# EAGLE design LCD BOARD (EAGLE 6.3)
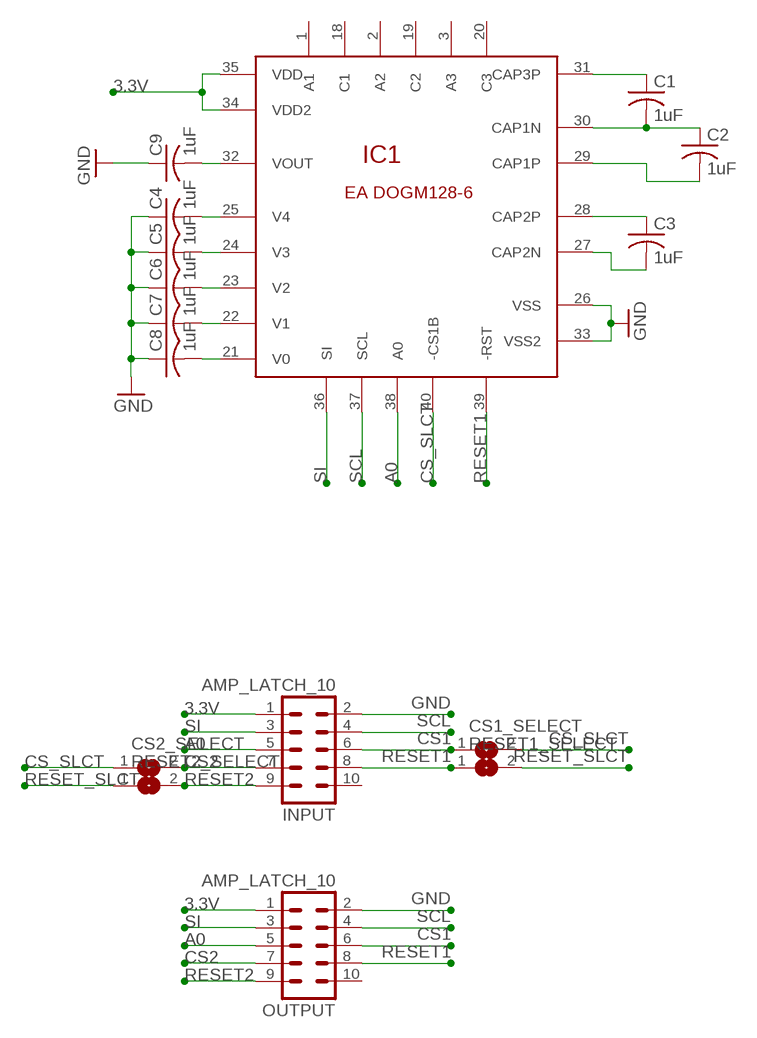
[diagram p0: schematic, sheet 1]

## Parts
C1  1uF  C-USC1206  [C1206]
C2  1uF  C-USC1206  [C1206]
C3  1uF  C-USC1206  [C1206]
C4  1uF  C-USC1206  [C1206]
C5  1uF  C-USC1206  [C1206]
C6  1uF  C-USC1206  [C1206]
C7  1uF  C-USC1206  [C1206]
C8  1uF  C-USC1206  [C1206]
C9  1uF  C-USC1206  [C1206]
CS1_SELECT  SJ  [SJ]
CS2_SELECT  SJ  [SJ]
IC1  EADOGM128  [EADOGM128]
INPUT  AMP_LATCH_10  [MA05-2]
OUTPUT  AMP_LATCH_10  [MA05-2]
RESET1_SELECT  SJ  [SJ]
RESET2_SELECT  SJ  [SJ]

## Nets
3.3V: IC1.34(VDD2) IC1.35(VDD) INPUT.1 OUTPUT.1
A0: IC1.38(A0) INPUT.5 OUTPUT.5
CS1: CS1_SELECT.1 INPUT.6 OUTPUT.6
CS2: CS2_SELECT.2 INPUT.7 OUTPUT.7
CS_SLCT: CS1_SELECT.2 CS2_SELECT.1 IC1.40(-CS1B)
GND: C4.1 C5.1 C6.1 C7.1 C8.1 C9.1 IC1.26(VSS) IC1.33(VSS2) INPUT.2 OUTPUT.2
N$1: C1.2 C2.1 IC1.30(CAP1N)
N$2: C1.1 IC1.31(CAP3P)
N$3: C2.2 IC1.29(CAP1P)
N$4: C3.2 IC1.27(CAP2N)
N$5: C3.1 IC1.28(CAP2P)
N$6: C9.2 IC1.32(VOUT)
N$7: C4.2 IC1.25(V4)
N$8: C5.2 IC1.24(V3)
N$9: C6.2 IC1.23(V2)
N$10: C7.2 IC1.22(V1)
N$11: C8.2 IC1.21(V0)
RESET1: IC1.39(-RST) INPUT.8 OUTPUT.8 RESET1_SELECT.1
RESET2: INPUT.9 OUTPUT.9 RESET2_SELECT.2
RESET_SLCT: RESET1_SELECT.2 RESET2_SELECT.1
SCL: IC1.37(SCL) INPUT.4 OUTPUT.4
SI: IC1.36(SI) INPUT.3 OUTPUT.3
Unconnected: IC1.1(A1) IC1.2(A2) IC1.3(A3) IC1.18(C1) IC1.19(C2) IC1.20(C3) INPUT.10 OUTPUT.10

## Library data of the parts
C1-C9 = rcl:C-US: CAPACITOR, American symbol
CS1_SELECT CS2_SELECT RESET1_SELECT RESET2_SELECT = jumper:SJ: SMD solder JUMPER
IC1 = ea-dogm:EADOGM128
INPUT OUTPUT = SolarJackets_Common:AMP_LATCH_10; PART_NUM: 5499922-1

## Board
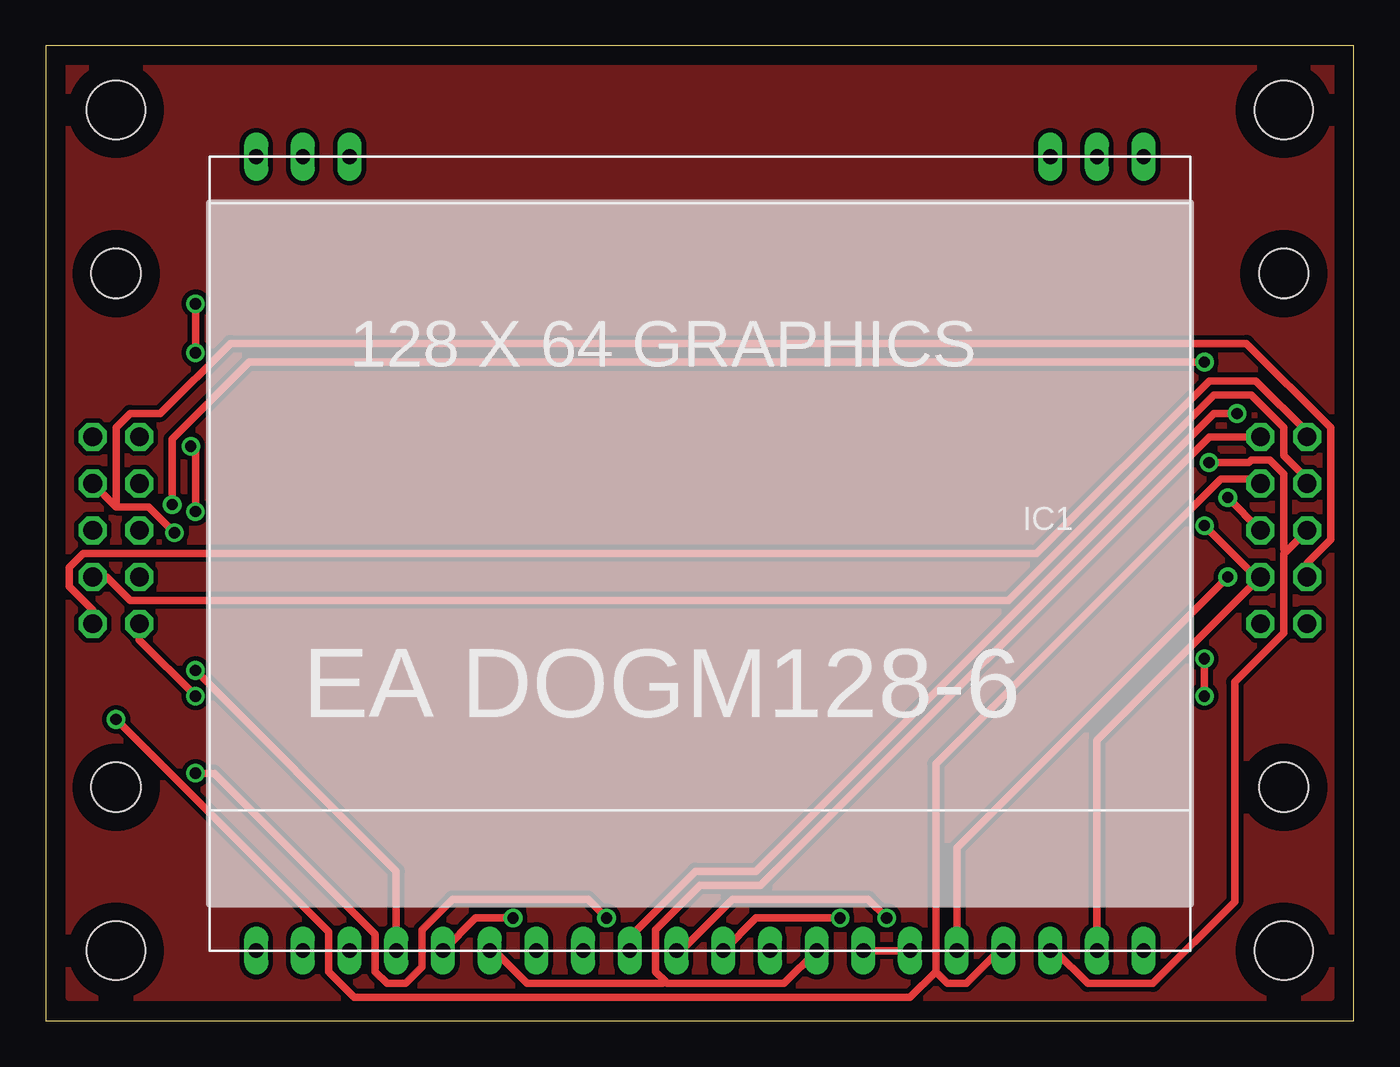
[diagram p1: board, top side]
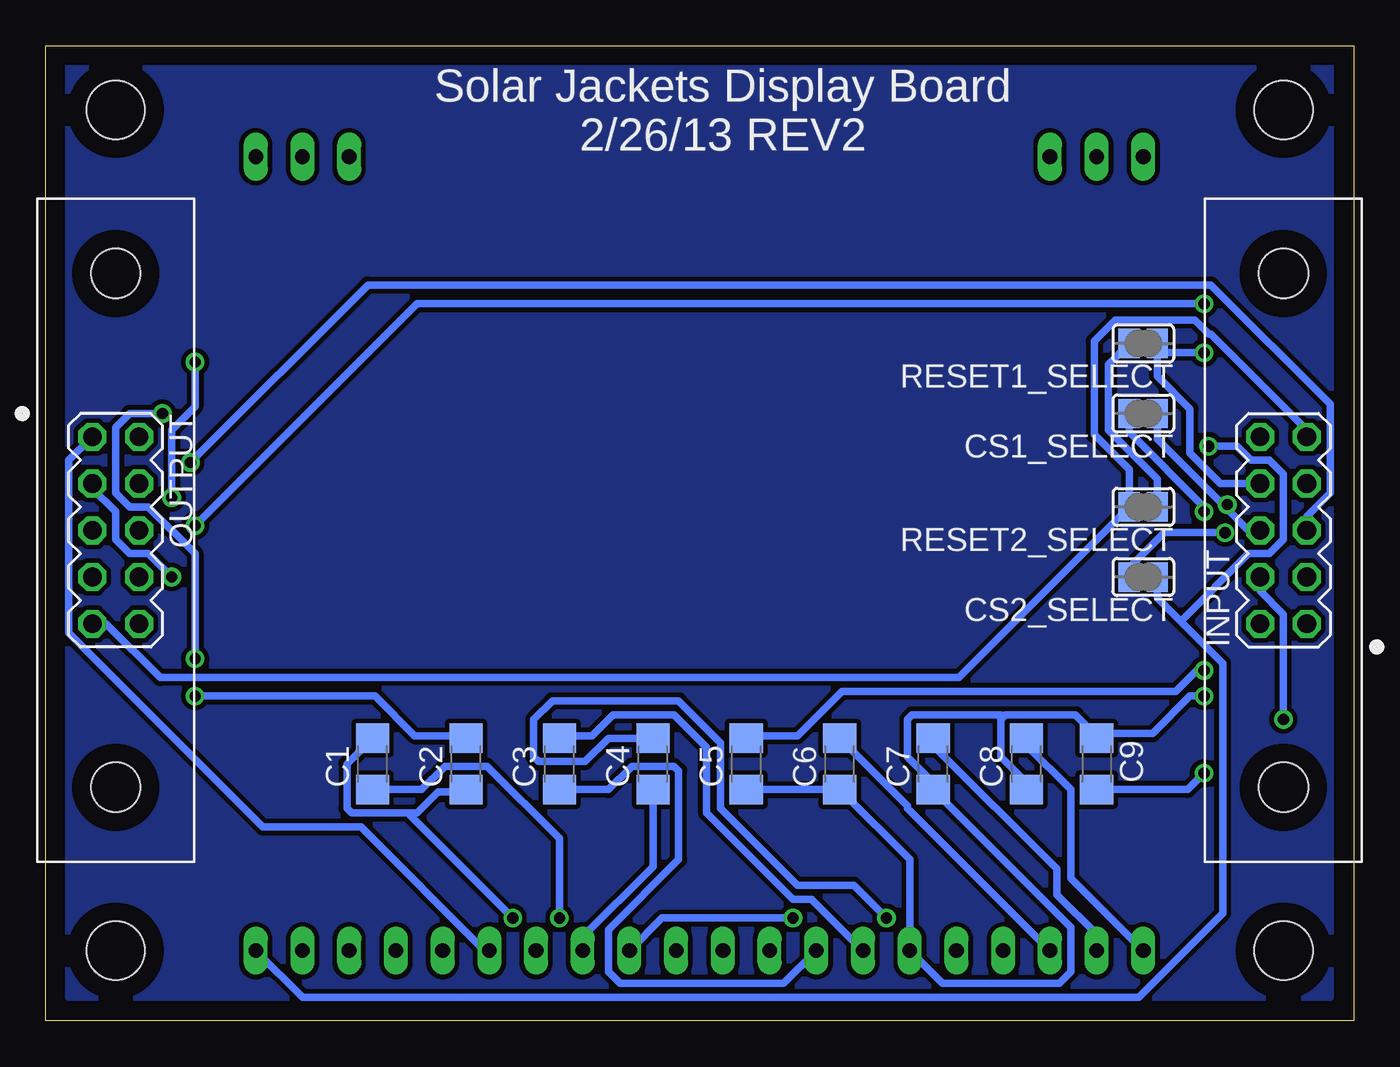
[diagram p2: board, bottom side, seen from below]

Size 71.1 x 53.01 mm. Coordinates in mm from the lower left corner, seen from the top.
Outline: 0,0 71.1,0 71.1,53.01 0,53.01 0,0
Copper layers (1*16): Top 0.035mm / dielectric 1.5mm / Bottom 0.035mm
Design rules "SJ Design Rules": minimum track width 16mil, minimum drill 24mil, track to track 10mil, track to pad 10mil, pad to pad 10mil, via to via 10mil, smd to smd 10mil, copper to edge 40mil, drill to drill 10mil, minimum pad ring 10mil, minimum via ring 8mil, stop-mask expansion 4mil, vias tented up to drill 0mil, thermal gap 20mil
Holes 3.17 mm at 3.81,3.81 67.31,3.81 67.31,49.53 3.81,49.53
vRestrict: area 8.9,6.3 to 62.2,44.5

### Footprints (pad centres in the part's own frame; a part is rotated, then mirrored left to right if it is on the bottom)
C1206 = smd 1.6 x 1.8: 1 -1.4,0; 2 1.4,0
SJ = smd 1.168 x 1.6: 1 -0.762,0; 2 0.762,0
EADOGM128 = drill 0.8 long: 1 -25.4,-21.59; 2 -22.86,-21.59; 3 -20.32,-21.59; 18 17.78,-21.59; 19 20.32,-21.59; 20 22.86,-21.59; 21 22.86,21.59; 22 20.32,21.59; 23 17.78,21.59; 24 15.24,21.59; 25 12.7,21.59; 26 10.16,21.59; 27 7.62,21.59; 28 5.08,21.59; 29 2.54,21.59; 30 0,21.59; 31 -2.54,21.59; 32 -5.08,21.59; 33 -7.62,21.59; 34 -10.16,21.59; 35 -12.7,21.59; 36 -15.24,21.59; 37 -17.78,21.59; 38 -20.32,21.59; 39 -22.86,21.59; 40 -25.4,21.59
MA05-2 = drill 1.016 octagon: 1 -5.08,-1.27; 2 -5.08,1.27; 3 -2.54,-1.27; 4 -2.54,1.27; 5 0,-1.27; 6 0,1.27; 7 2.54,-1.27; 8 2.54,1.27; 9 5.08,-1.27; 10 5.08,1.27 | hole 2.692: -13.97,0; 13.97,0

### Placement (x,y rotation side)
C1  53.34,13.97 90 bottom
C2  48.26,13.97 90 bottom
C3  43.18,13.97 90 bottom
C4  38.1,13.97 90 bottom
C5  33.02,13.97 90 bottom
C6  27.94,13.97 90 bottom
C7  22.86,13.97 90 bottom
C8  17.78,13.97 90 bottom
C9  13.97,13.97 270 bottom
CS1_SELECT  11.43,33.02 180 bottom
CS2_SELECT  11.43,24.13 180 bottom
IC1  34.29,25.4 180 top
INPUT  3.81,26.67 90 bottom
OUTPUT  67.31,26.67 270 bottom
RESET1_SELECT  11.43,36.83 180 bottom
RESET2_SELECT  11.43,27.94 180 bottom

### Tracks (layer width: path | path; a pad name or v marks a point on that pad's centre or on a via)
3.3V
  Top 0.406: IC1.35 IC1.34 | INPUT.1 2.54,22.35 1.27,23.62 1.27,24.64 2.03,25.4 53.85,25.4 63.25,34.8 65.79,34.8 68.58,32 OUTPUT.1
  Bottom 0.406: IC1.35 47.24,3.81 53.98,10.54 59.31,10.54 69.85,21.08 69.85,30.48 OUTPUT.1
A0  (via drill 0.61)
  Top 0.406: IC1.38 54.86,3.81 56.64,2.03 60.2,2.03 64.64,6.48 64.64,18.41 67.31,21.08 67.31,25.4 67.44,25.53 | OUTPUT.5 67.44,25.53 | v63.25,30.35 65.41,30.35 65.53,30.48 66.55,30.48 67.31,29.72 67.31,25.65 67.44,25.53
  Bottom 0.406: INPUT.5 2.54,27.43 1.27,28.7 1.27,33.53 7.75,40.01 53.59,40.01 v63.25,30.35
CS1  (via drill 0.61)
  Top 0.406: v64.26,28.45 OUTPUT.6 | v62.99,35.81 11.05,35.81 6.86,31.62 v6.86,28.07
  Bottom 0.406: CS1_SELECT.1 10.67,31.62 6.99,27.94 | 6.99,27.94 5.71,26.67 INPUT.6 | v64.26,28.45 64.26,32.13 62.99,33.4 v62.99,35.81 | v6.86,28.07 6.99,27.94
CS2  (via drill 0.61)
  Top 0.406: v6.99,26.54 5.59,27.94 3.81,27.94 3.68,28.07 | INPUT.7 3.68,28.07 | OUTPUT.7 68.58,24.89 69.85,26.16 69.85,32.26 65.28,36.83 10.03,36.83 6.22,33.02 4.57,33.02 3.81,32.26 3.81,28.19 3.68,28.07
  Bottom 0.406: CS2_SELECT.2 12.19,24.64 10.29,26.54 v6.99,26.54
CS_SLCT  (via drill 0.61)
  Top 0.406: v8.13,27.69 8.13,30.99 v7.87,31.24
  Bottom 0.406: CS2_SELECT.1 10.67,22.99 9.4,21.72 | 9.4,21.72 7.11,19.43 7.11,5.84 11.68,1.27 57.15,1.27 IC1.40 | CS1_SELECT.2 12.19,32 8.13,27.94 v8.13,27.69 | v7.87,31.24 6.35,31.24 5.59,30.48 4.57,30.48 3.81,29.72 3.81,26.16 4.57,25.4 5.71,25.4 9.4,21.72
GND  (via drill 0.61)
  Top 0.406: INPUT.2 5.08,20.7 v8.13,17.65 | OUTPUT.2 63.25,31.75 38.86,7.37 35.56,7.37 33.15,4.95 33.15,2.67 33.66,2.16 | 33.66,2.16 33.78,2.03 40.13,2.03 IC1.33 | IC1.26 24.38,3.81 26.16,2.03 33.53,2.03 33.66,2.16
  Bottom 0.406: C8.1 17.78,12.95 19.18,14.35 19.18,16.38 19.05,16.51 | 19.05,16.51 18.92,16.64 15.11,16.64 13.97,15.49 C9.1 13.84,15.62 10.92,15.62 8.89,17.65 v8.13,17.65 | 19.05,16.51 19.18,16.64 24,16.64 24.26,16.38 24.26,14.35 22.86,12.95 C7.1 22.73,12.45 15.37,5.08 15.37,2.67 16,2.03 22.35,2.03 IC1.26 24.13,8.76 27.81,12.45 C6.1 C5.1 | C4.1 38.1,8.38 41.91,4.57 IC1.33
N$1  (via drill 0.61)
  Top 0.406: IC1.30 34.54,3.81 37.34,6.6 44.7,6.6 v45.72,5.59
  Bottom 0.406: 51.31,11.3 54.48,11.3 54.74,11.56 54.74,13.97 C1.2 | 51.31,11.3 50.93,11.3 49.78,12.45 48.26,12.45 C2.1 | v45.72,5.59 51.31,11.18 51.31,11.3
N$2  (via drill 0.61)
  Top 0.406: v43.18,5.59 38.61,5.59 IC1.31
  Bottom 0.406: v43.18,5.59 43.18,9.91 47.12,13.84 49.4,13.84 50.67,12.57 C1.1
N$3  (via drill 0.61)
  Top 0.406: v62.99,19.68 v62.99,17.65 | v64.77,33.02 63.5,33.02 38.61,8.13 35.31,8.13 31.75,4.57 IC1.29
  Bottom 0.406: v62.99,17.65 53.21,17.65 51.05,15.49 48.26,15.49 C2.2 | v62.99,19.68 62.99,25.4 65.53,27.94 66.55,27.94 67.31,28.7 67.31,32.26 66.55,33.02 v64.77,33.02
N$4
  Bottom 0.406: IC1.27 29.46,6.6 30.48,6.6 35.18,11.3 35.18,14.86 36.96,16.64 40.26,16.64 41.4,15.49 43.18,15.49 C3.2
N$5
  Bottom 0.406: IC1.28 30.99,2.03 39.88,2.03 40.51,2.67 40.51,4.95 36.7,8.76 36.7,13.59 36.96,13.84 39.24,13.84 40.51,12.57 C3.1
N$6  (via drill 0.61)
  Top 0.406: v8.13,13.46 9.14,13.46 17.91,4.7 17.91,2.67 18.54,2.03 19.56,2.03 20.45,2.92 20.45,4.95 22.1,6.6 29.46,6.6 v30.48,5.59
  Bottom 0.406: v8.13,13.46 9.02,12.57 C9.2 | v30.48,5.59 37.59,5.59 IC1.32
N$7  (via drill 0.61)
  Top 0.406: v25.4,5.59 23.37,5.59 IC1.25
  Bottom 0.406: v25.4,5.59 27.18,7.37 30.23,7.37 34.42,11.56 34.42,15.11 36.7,17.4 43.56,17.4 44.58,16.38 44.58,14.35 44.32,14.1 41.78,14.1 40.51,15.37 C4.2
N$8  (via drill 0.61)
  Top 0.406: v8.13,19.05 19.05,8.13 IC1.24
  Bottom 0.406: v8.13,19.05 8.51,19.05 9.65,17.91 27.81,17.91 30.23,15.49 33.02,15.49 C5.2
N$9
  Bottom 0.406: IC1.23 24.26,11.56 24.26,11.68 C6.2
N$10
  Bottom 0.406: C7.2 22.86,14.99 16.13,8.26 16.13,6.86 13.97,4.7 IC1.22
N$11
  Bottom 0.406: C8.2 17.78,14.99 15.37,12.57 15.37,7.75 IC1.21
RESET1  (via drill 0.61)
  Top 0.406: IC1.39 57.15,15.24 OUTPUT.8 65.79,24.13 v62.99,26.92 | v8.13,38.99 v8.13,36.32
  Bottom 0.406: INPUT.8 7.24,29.21 8.89,30.86 8.89,33.27 10.67,35.05 RESET1_SELECT.1 10.54,36.32 v8.13,36.32 | v8.13,38.99 50.93,38.99 v62.99,26.92
RESET2
  Bottom 0.406: INPUT.9 2.54,32.13 7.75,37.34 7.87,37.34 8.64,38.1 12.95,38.1 14.1,36.96 14.1,31.88 12.19,29.97 RESET2_SELECT.2 21.46,18.67 64.9,18.67 67.82,21.59 OUTPUT.9
RESET_SLCT
  Bottom 0.406: RESET2_SELECT.1 10.67,29.46 13.34,32.13 13.34,35.69 RESET1_SELECT.2
SCL  (via drill 0.61)
  Top 0.406: IC1.37 51.82,3.81 50.04,2.03 49.02,2.03 48.39,2.67 | 48.39,2.67 48.39,13.97 63.88,29.46 65.79,29.46 OUTPUT.4 | v3.81,16.38 15.37,4.83 15.37,2.67 16.76,1.27 46.99,1.27 48.39,2.67
  Bottom 0.406: INPUT.4 5.08,23.37 3.81,22.1 v3.81,16.38
SI  (via drill 0.61)
  Top 0.406: IC1.36 49.53,9.4 v64.26,24.13 | INPUT.3 3.3,24.13 4.57,22.86 52.32,22.86 63.5,34.04 65.53,34.04 67.31,32.26 67.31,30.73 68.58,29.46 OUTPUT.3
  Bottom 0.406: v64.26,24.13 65.53,25.4 66.55,25.4 67.31,26.16 67.31,27.69 68.58,28.96 OUTPUT.3
SIDE1
  pour Bottom: 1.27,52.07 69.85,52.07 69.85,1.27 1.27,1.27
  pour Top: 69.85,1.27 1.27,1.27 1.27,52.07 69.85,52.07

### Text on the board
bPlace: Solar Jackets Display Board / 2/26/13 REV2
bValues: PINOUTS / 1: 3.3V / 2: GND / 3: SI / 4: SCL / 5: A0 / 6: CS1 / 7: CS2 / 8: RESET1 / 9: RESET2